# Altium schematic sheet 4th_main.SchDoc
size A1
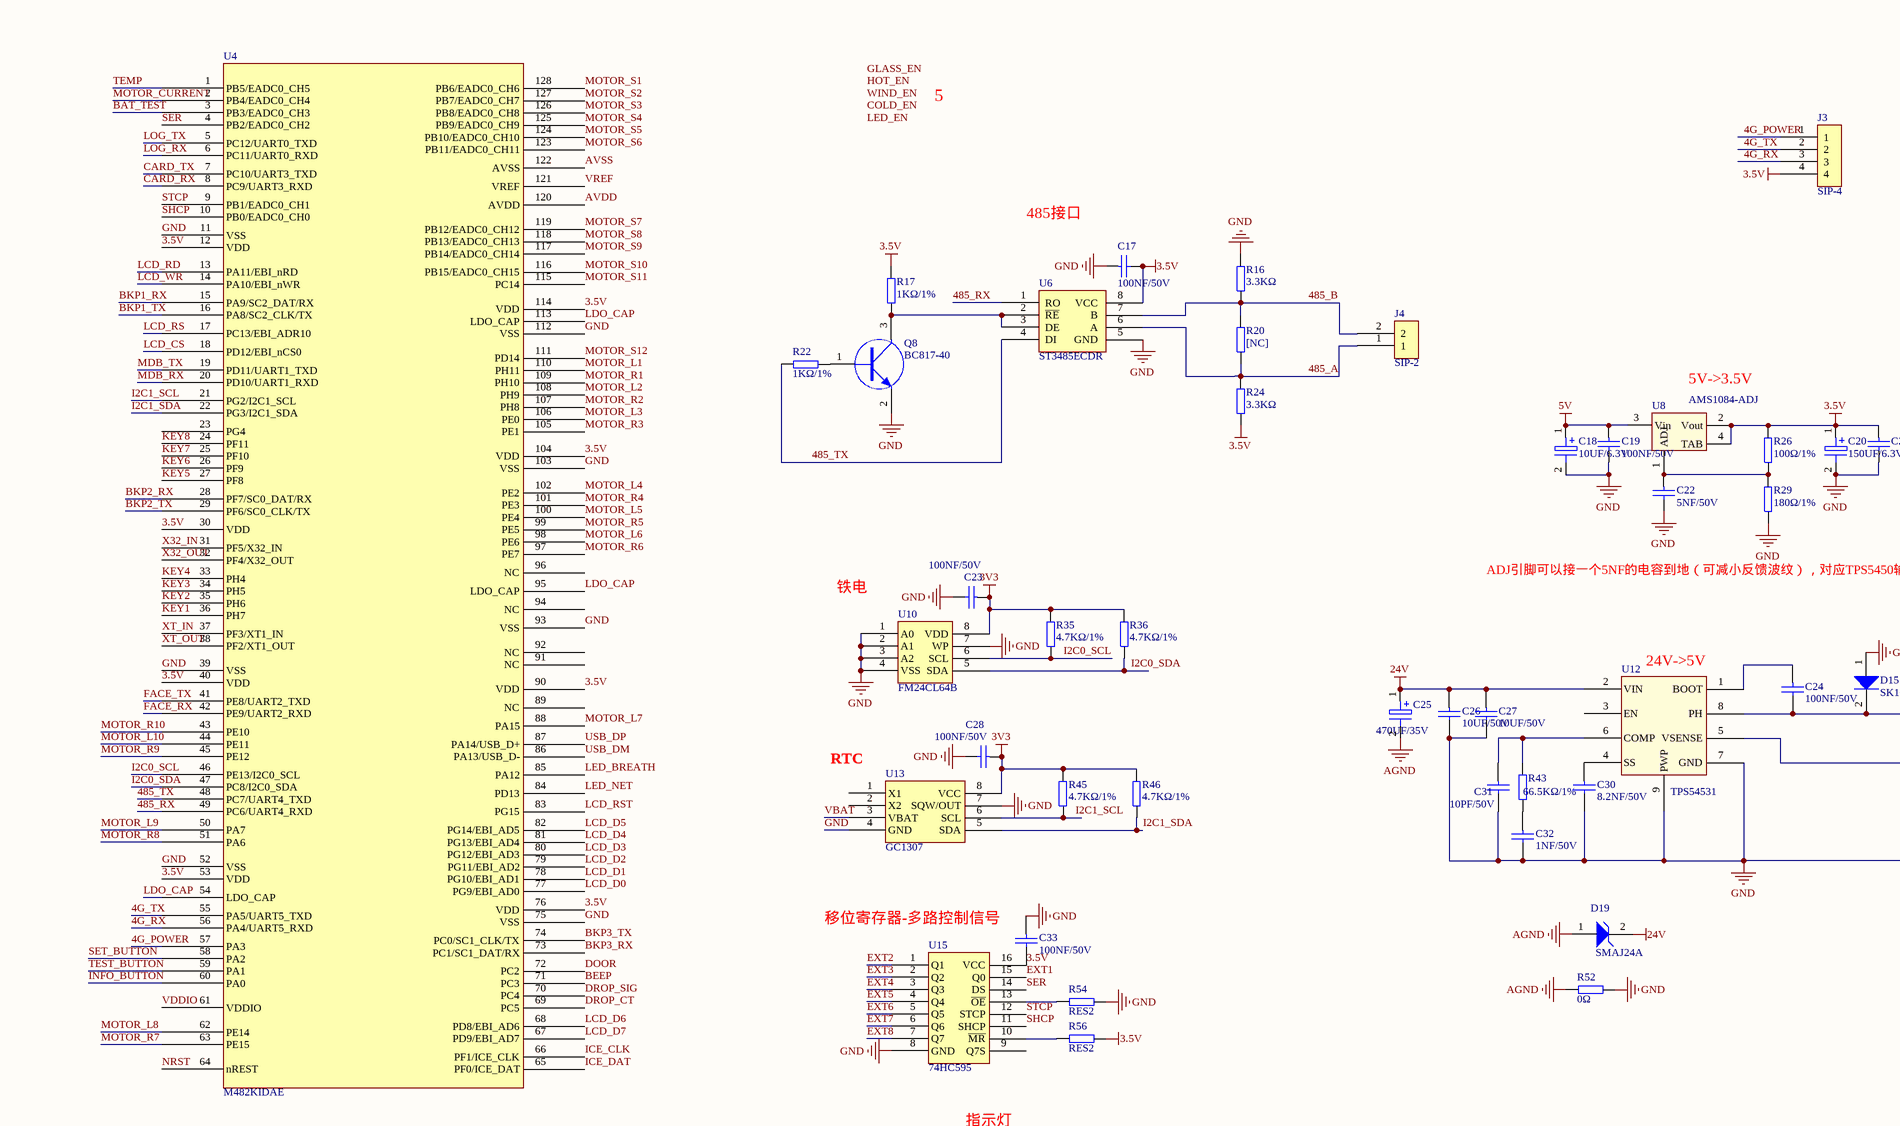
[diagram p0: 4th_main.SchDoc, top left]
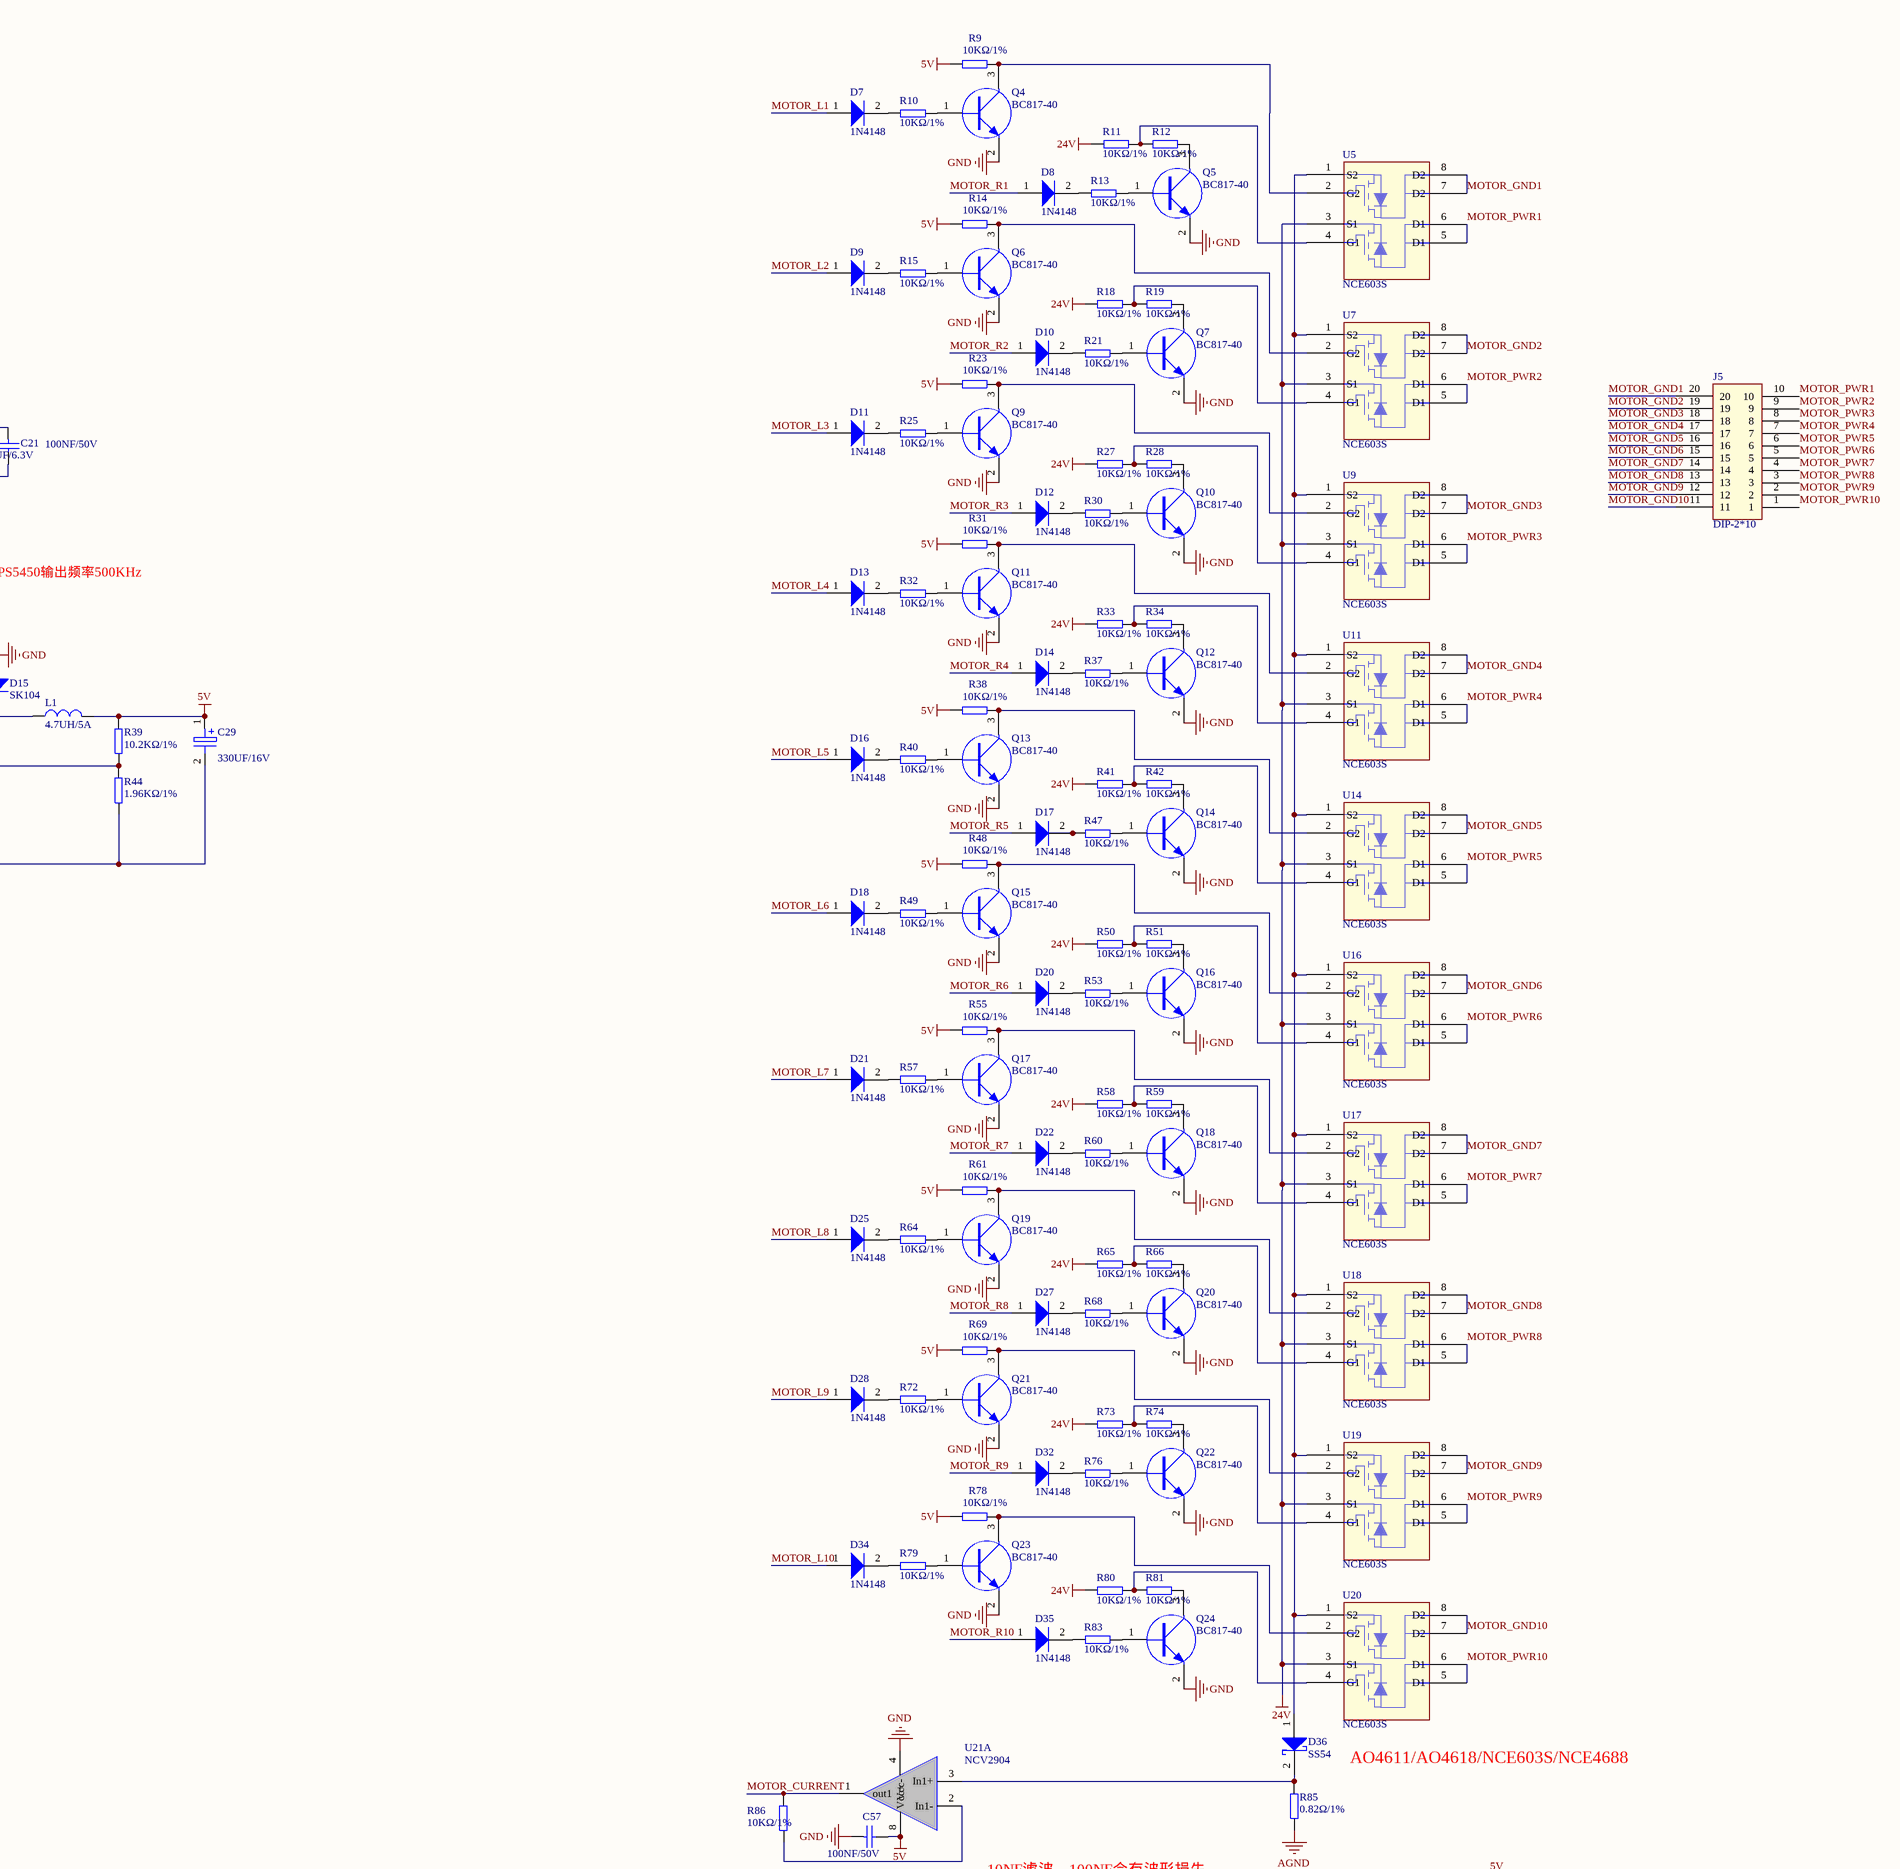
[diagram p1: 4th_main.SchDoc, top right]
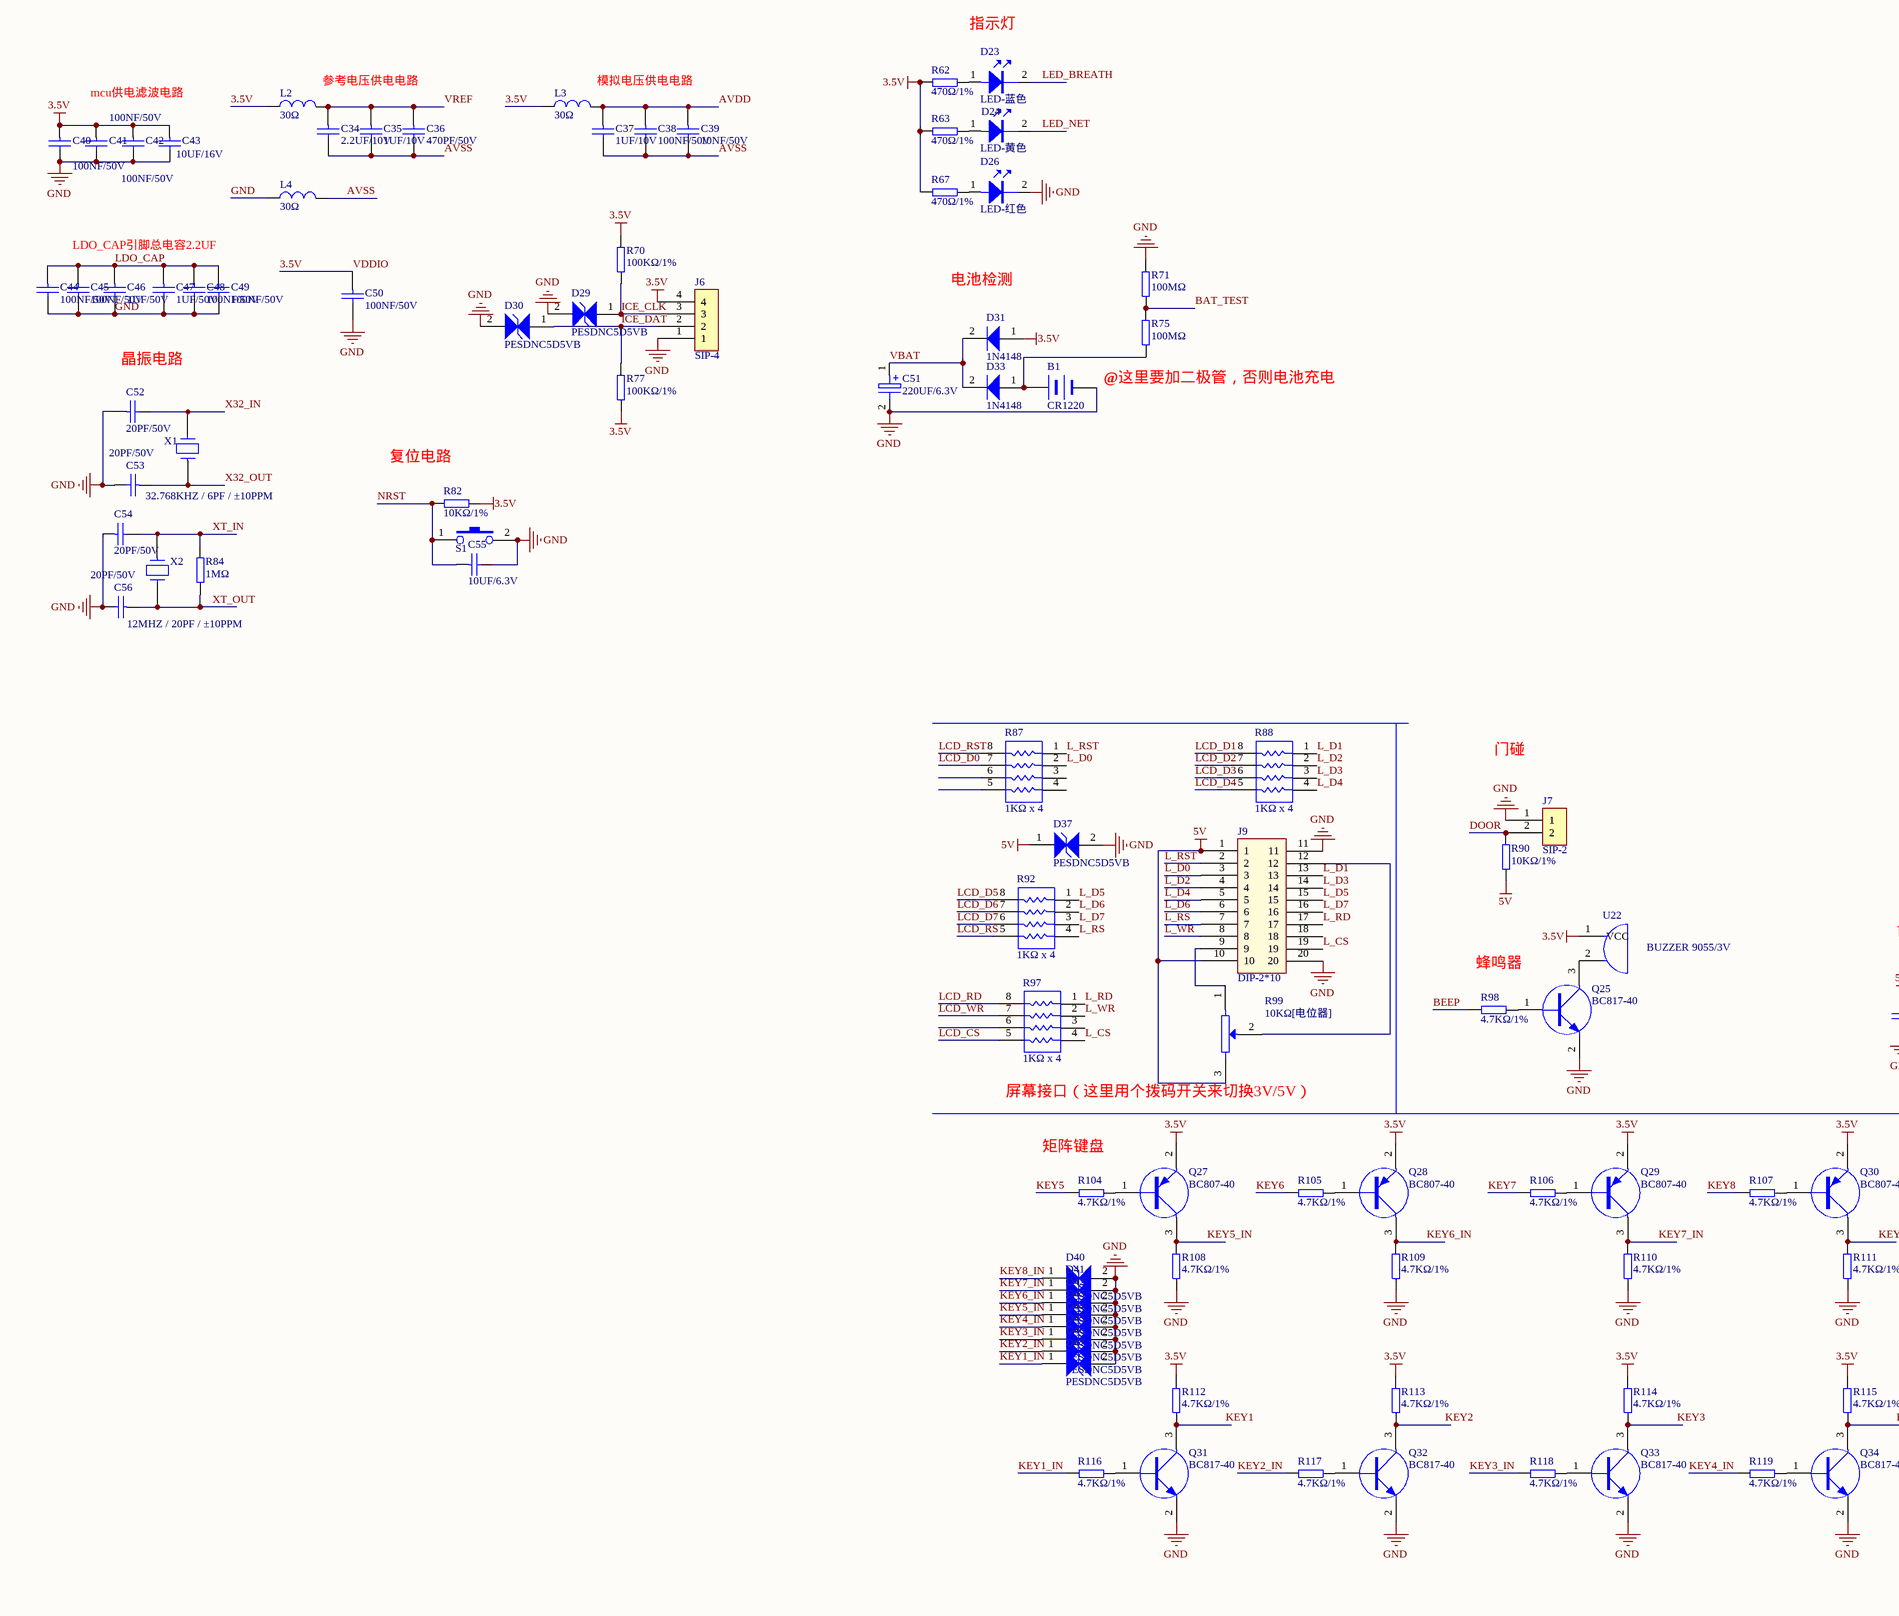
[diagram p2: 4th_main.SchDoc, bottom left]
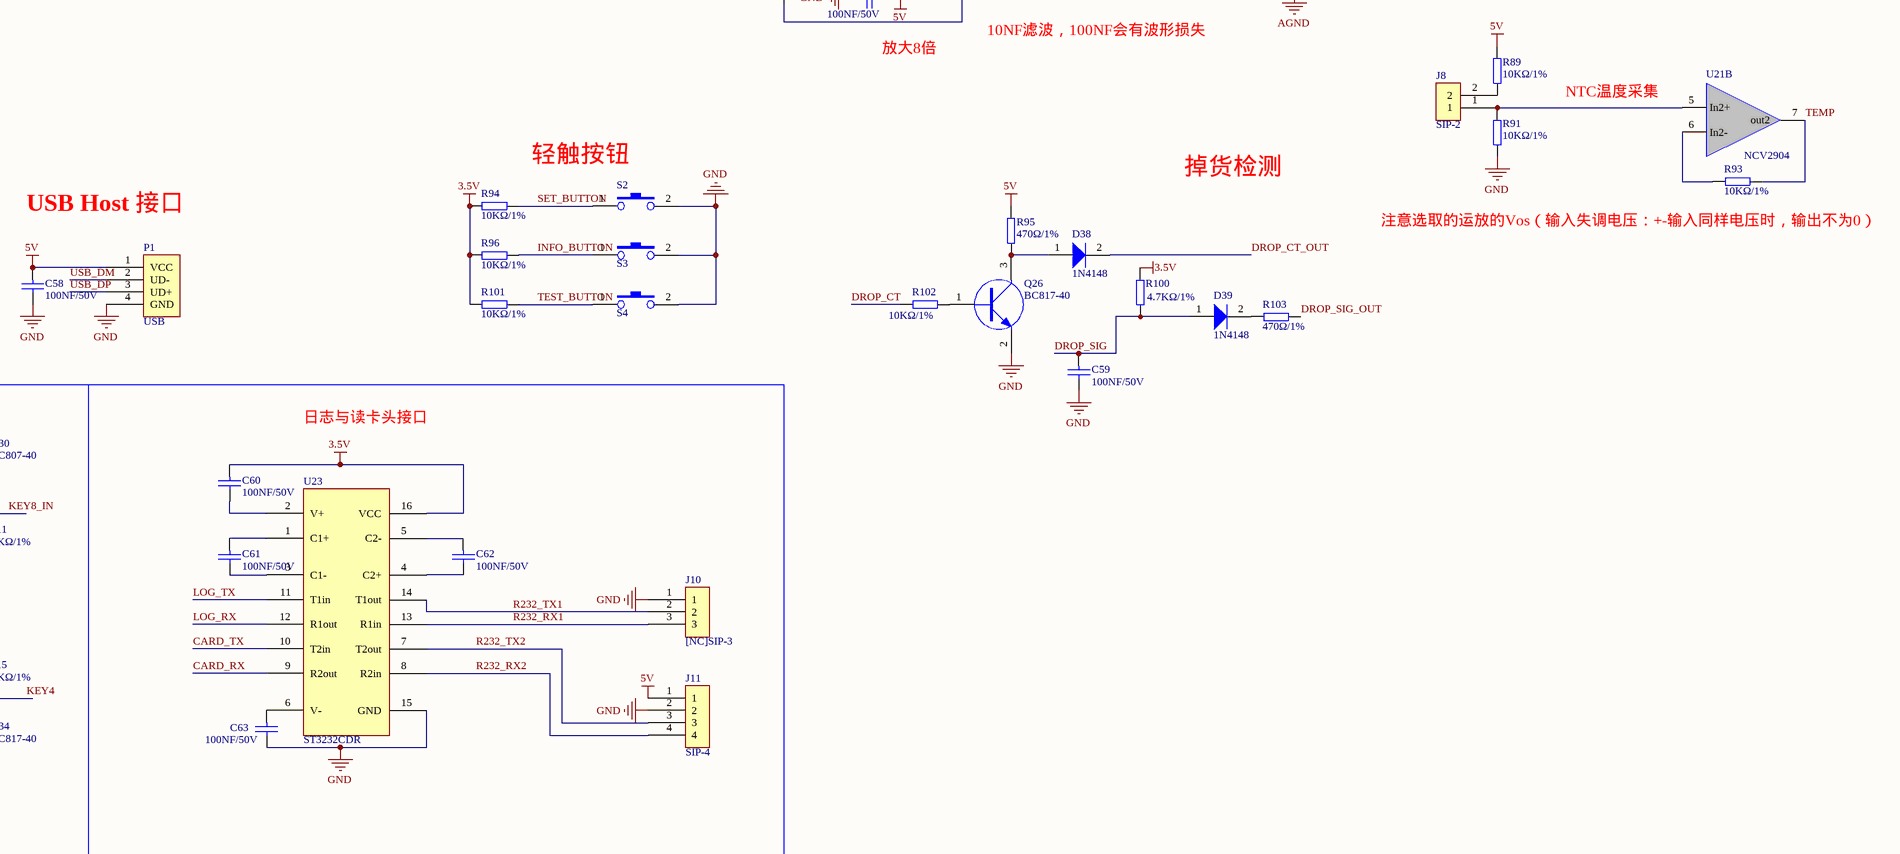
[diagram p3: 4th_main.SchDoc, bottom right]

## Parts
B1  CR1220  [CR1220]
C17  100NF/50V  [0603_C]
C18  10UF/6.3V  [CASE-A_3216]
C19  100NF/50V  [0603_C]
C20  150UF/6.3V  [CASE-B_3528]
C21  100NF/50V  [0603_C]
C22  5NF/50V  [0603_C]
C23  100NF/50V  [0603_C]
C24  100NF/50V  [0603_C]
C25  470UF/35V  [CAP-TH_BD10.0-P5.00-D1.0-FD]
C26  10UF/50V  [1206_C]
C27  10UF/50V  [1206_C]
C28  100NF/50V  [0603_C]
C29  330UF/16V  [CAP-TH_BD8.0-P3.50-D1.0-FD]
C30  8.2NF/50V  [0603_C]
C31  10PF/50V  [0603_C]
C32  1NF/50V  [0603_C]
C33  100NF/50V  [0603_C]
C34  2.2UF/10V  [0603_C]
C35  1UF/10V  [0603_C]
C36  470PF/50V  [0603_C]
C37  1UF/10V  [0603_C]
C38  100NF/50V  [0603_C]
C39  10NF/50V  [0603_C]
C40  100NF/50V  [0603_C]
C41  100NF/50V  [0603_C]
C42  100NF/50V  [0603_C]
C43  10UF/16V  [0603_C]
C44  100NF/50V  [0603_C]
C45  100NF/50V  [0603_C]
C46  1UF/50V  [0603_C]
C47  1UF/50V  [0603_C]
C48  100NF/50V  [0603_C]
C49  100NF/50V  [0603_C]
C50  100NF/50V  [0603_C]
C51  220UF/6.3V  [CASE-B_3528]
C52  20PF/50V  [0603_C]
C53  20PF/50V  [0603_C]
C54  20PF/50V  [0603_C]
C55  10UF/6.3V  [0603_C]
C56  20PF/50V  [0603_C]
C57  100NF/50V  [0603_C]
C58  100NF/50V  [0603_C]
C59  100NF/50V  [0603_C]
C60  100NF/50V  [0603_C]
C61  100NF/50V  [0603_C]
C62  100NF/50V  [0603_C]
C63  100NF/50V  [0603_C]
D7  1N4148  [SOD-123_L2.8-W1.8-LS3.7-RD]
D8  1N4148  [SOD-123_L2.8-W1.8-LS3.7-RD]
D9  1N4148  [SOD-123_L2.8-W1.8-LS3.7-RD]
D10  1N4148  [SOD-123_L2.8-W1.8-LS3.7-RD]
D11  1N4148  [SOD-123_L2.8-W1.8-LS3.7-RD]
D12  1N4148  [SOD-123_L2.8-W1.8-LS3.7-RD]
D13  1N4148  [SOD-123_L2.8-W1.8-LS3.7-RD]
D14  1N4148  [SOD-123_L2.8-W1.8-LS3.7-RD]
D15  SK104  [SMC/DO214AB]
D16  1N4148  [SOD-123_L2.8-W1.8-LS3.7-RD]
D17  1N4148  [SOD-123_L2.8-W1.8-LS3.7-RD]
D18  1N4148  [SOD-123_L2.8-W1.8-LS3.7-RD]
D19  SMAJ24A  [SMA/DO214AC]
D20  1N4148  [SOD-123_L2.8-W1.8-LS3.7-RD]
D21  1N4148  [SOD-123_L2.8-W1.8-LS3.7-RD]
D22  1N4148  [SOD-123_L2.8-W1.8-LS3.7-RD]
D23  LED-蓝色  [0603_D]
D24  LED-黄色  [0603_D]
D25  1N4148  [SOD-123_L2.8-W1.8-LS3.7-RD]
D26  LED-红色  [0603_D]
D27  1N4148  [SOD-123_L2.8-W1.8-LS3.7-RD]
D28  1N4148  [SOD-123_L2.8-W1.8-LS3.7-RD]
D29  PESDNC5D5VB  [SOD-523]
D30  PESDNC5D5VB  [SOD-523]
D31  1N4148  [LL34_2P]
D32  1N4148  [SOD-123_L2.8-W1.8-LS3.7-RD]
D33  1N4148  [LL34_2P]
D34  1N4148  [SOD-123_L2.8-W1.8-LS3.7-RD]
D35  1N4148  [SOD-123_L2.8-W1.8-LS3.7-RD]
D36  SS54  [SMA/DO214AC]
D37  PESDNC5D5VB  [SOD-523]
D38  1N4148  [SOD-123_L2.8-W1.8-LS3.7-RD]
D39  1N4148  [SOD-123_L2.8-W1.8-LS3.7-RD]
D40  PESDNC5D5VB  [SOD-523]
D41  PESDNC5D5VB  [SOD-523]
D42  PESDNC5D5VB  [SOD-523]
D43  PESDNC5D5VB  [SOD-523]
D44  PESDNC5D5VB  [SOD-523]
D45  PESDNC5D5VB  [SOD-523]
D46  PESDNC5D5VB  [SOD-523]
D47  PESDNC5D5VB  [SOD-523]
J3  SIP-4  [XHB-4A]
J4  SIP-2  [PHS-2AW]
J5  DIP-2*10  [5557-2*10A]
J6  SIP-4  [XHB-4A]
J7  SIP-2  [PHS-2AW]
J8  SIP-2  [XHB-2A]
J9  DIP-2*10  [PHB-2*10AW]
J10  [NC]SIP-3  [XHB-3A]
J11  SIP-4  [PHS-4AW]
L1  4.7UH/5A  [IND-SMD_0630]
L2  30Ω  [0603_L]
L3  30Ω  [0603_L]
L4  30Ω  [0603_L]
P1  USB  [USB-180度-10mm超短]
Q4  BC817-40  [SOT-23-3]
Q5  BC817-40  [SOT-23-3]
Q6  BC817-40  [SOT-23-3]
Q7  BC817-40  [SOT-23-3]
Q8  BC817-40  [SOT-23-3]
Q9  BC817-40  [SOT-23-3]
Q10  BC817-40  [SOT-23-3]
Q11  BC817-40  [SOT-23-3]
Q12  BC817-40  [SOT-23-3]
Q13  BC817-40  [SOT-23-3]
Q14  BC817-40  [SOT-23-3]
Q15  BC817-40  [SOT-23-3]
Q16  BC817-40  [SOT-23-3]
Q17  BC817-40  [SOT-23-3]
Q18  BC817-40  [SOT-23-3]
Q19  BC817-40  [SOT-23-3]
Q20  BC817-40  [SOT-23-3]
Q21  BC817-40  [SOT-23-3]
Q22  BC817-40  [SOT-23-3]
Q23  BC817-40  [SOT-23-3]
Q24  BC817-40  [SOT-23-3]
Q25  BC817-40  [SOT-23-3]
Q26  BC817-40  [SOT-23-3]
Q27  BC807-40  [SOT-23-3]
Q28  BC807-40  [SOT-23-3]
Q29  BC807-40  [SOT-23-3]
Q30  BC807-40  [SOT-23-3]
Q31  BC817-40  [SOT-23-3]
Q32  BC817-40  [SOT-23-3]
Q33  BC817-40  [SOT-23-3]
Q34  BC817-40  [SOT-23-3]
R9  10KΩ/1%  [0603_R]
R10  10KΩ/1%  [0603_R]
R11  10KΩ/1%  [0603_R]
R12  10KΩ/1%  [0603_R]
R13  10KΩ/1%  [0603_R]
R14  10KΩ/1%  [0603_R]
R15  10KΩ/1%  [0603_R]
R16  3.3KΩ  [0603_R]
R17  1KΩ/1%  [0603_R]
R18  10KΩ/1%  [0603_R]
R19  10KΩ/1%  [0603_R]
R20  [NC]  [0603_R]
R21  10KΩ/1%  [0603_R]
R22  1KΩ/1%  [0603_R]
R23  10KΩ/1%  [0603_R]
R24  3.3KΩ  [0603_R]
R25  10KΩ/1%  [0603_R]
R26  100Ω/1%  [0603_R]
R27  10KΩ/1%  [0603_R]
R28  10KΩ/1%  [0603_R]
R29  180Ω/1%  [0603_R]
R30  10KΩ/1%  [0603_R]
R31  10KΩ/1%  [0603_R]
R32  10KΩ/1%  [0603_R]
R33  10KΩ/1%  [0603_R]
R34  10KΩ/1%  [0603_R]
R35  4.7KΩ/1%  [0603_R]
R36  4.7KΩ/1%  [0603_R]
R37  10KΩ/1%  [0603_R]
R38  10KΩ/1%  [0603_R]
R39  10.2KΩ/1%  [0603_R]
R40  10KΩ/1%  [0603_R]
R41  10KΩ/1%  [0603_R]
R42  10KΩ/1%  [0603_R]
R43  66.5KΩ/1%  [0603_R]
R44  1.96KΩ/1%  [0603_R]
R45  4.7KΩ/1%  [0603_R]
R46  4.7KΩ/1%  [0603_R]
R47  10KΩ/1%  [0603_R]
R48  10KΩ/1%  [0603_R]
R49  10KΩ/1%  [0603_R]
R50  10KΩ/1%  [0603_R]
R51  10KΩ/1%  [0603_R]
R52  0Ω  [1812_R]
R53  10KΩ/1%  [0603_R]
R54  RES2  [0603_R]
R55  10KΩ/1%  [0603_R]
R56  RES2  [0603_R]
R57  10KΩ/1%  [0603_R]
R58  10KΩ/1%  [0603_R]
R59  10KΩ/1%  [0603_R]
R60  10KΩ/1%  [0603_R]
R61  10KΩ/1%  [0603_R]
R62  470Ω/1%  [0603_R]
R63  470Ω/1%  [0603_R]
R64  10KΩ/1%  [0603_R]
R65  10KΩ/1%  [0603_R]
R66  10KΩ/1%  [0603_R]
R67  470Ω/1%  [0603_R]
R68  10KΩ/1%  [0603_R]
R69  10KΩ/1%  [0603_R]
R70  100KΩ/1%  [0603_R]
R71  100MΩ  [0603_R]
R72  10KΩ/1%  [0603_R]
R73  10KΩ/1%  [0603_R]
R74  10KΩ/1%  [0603_R]
R75  100MΩ  [0603_R]
R76  10KΩ/1%  [0603_R]
R77  100KΩ/1%  [0603_R]
R78  10KΩ/1%  [0603_R]
R79  10KΩ/1%  [0603_R]
R80  10KΩ/1%  [0603_R]
R81  10KΩ/1%  [0603_R]
R82  10KΩ/1%  [0603_R]
R83  10KΩ/1%  [0603_R]
R84  1MΩ  [0603_R]
R85  0.82Ω/1%  [1812_R]
R86  10KΩ/1%  [0603_R]
R87  1KΩ x 4  [0402_Rx4]
R88  1KΩ x 4  [0402_Rx4]
R89  10KΩ/1%  [0603_R]
R90  10KΩ/1%  [0603_R]
R91  10KΩ/1%  [0603_R]
R92  1KΩ x 4  [0402_Rx4]
R93  10KΩ/1%  [0603_R]
R94  10KΩ/1%  [0603_R]
R95  470Ω/1%  [0603_R]
R96  10KΩ/1%  [0603_R]
R97  1KΩ x 4  [0402_Rx4]
R98  4.7KΩ/1%  [0603_R]
R99  10KΩ[电位器]  [3362P]
R100  4.7KΩ/1%  [0603_R]
R101  10KΩ/1%  [0603_R]
R102  10KΩ/1%  [0603_R]
R103  470Ω/1%  [0603_R]
R104  4.7KΩ/1%  [0603_R]
R105  4.7KΩ/1%  [0603_R]
R106  4.7KΩ/1%  [0603_R]
R107  4.7KΩ/1%  [0603_R]
R108  4.7KΩ/1%  [0603_R]
R109  4.7KΩ/1%  [0603_R]
R110  4.7KΩ/1%  [0603_R]
R111  4.7KΩ/1%  [0603_R]
R112  4.7KΩ/1%  [0603_R]
R113  4.7KΩ/1%  [0603_R]
R114  4.7KΩ/1%  [0603_R]
R115  4.7KΩ/1%  [0603_R]
R116  4.7KΩ/1%  [0603_R]
R117  4.7KΩ/1%  [0603_R]
R118  4.7KΩ/1%  [0603_R]
R119  4.7KΩ/1%  [0603_R]
S1  SW-PB  [SW-TH_4P-L12.0-W12.0-P5.00-LS12.5]  (value not drawn)
S2  SW-PB  [SW-6*6]  (value not drawn)
S3  SW-PB  [SW-6*6]  (value not drawn)
S4  SW-PB  [SW-6*6]  (value not drawn)
U4  M482KIDAE  [LQFP-128_L14.0-W14.0-P0.40-LS16.0-BL]
U5  NCE603S  [SO-8（1.27/3.8*5）]
U6  ST3485ECDR  [SO-8（1.27/3.8*5）]
U7  NCE603S  [SO-8（1.27/3.8*5）]
U8  AMS1084-ADJ  [TO-252]
U9  NCE603S  [SO-8（1.27/3.8*5）]
U10  FM24CL64B  [SO-8（1.27/3.8*5）]
U11  NCE603S  [SO-8（1.27/3.8*5）]
U12  TPS54531  [SO-8-POWERPAD（1.27/3.8*5）]
U13  GC1307  [SO-8（1.27/3.8*5）]
U14  NCE603S  [SO-8（1.27/3.8*5）]
U15  74HC595  [SO-16（1.27/3.8*10）]
U16  NCE603S  [SO-8（1.27/3.8*5）]
U17  NCE603S  [SO-8（1.27/3.8*5）]
U18  NCE603S  [SO-8（1.27/3.8*5）]
U19  NCE603S  [SO-8（1.27/3.8*5）]
U20  NCE603S  [SO-8（1.27/3.8*5）]
U21  NCV2904  [SO-8（1.27/3.8*5）]  (parts A,B of 2)
U22  BUZZER 9055/3V  [BUZZ-9055/5.0mm]
U23  ST3232CDR  [SO-16（1.27/3.8*10）]
X1  32.768KHZ / 6PF / ±10PPM  [SMD-3215-2P]
X2  12MHZ / 20PF / ±10PPM  [SMD-5032_2P]

## Nets
3.5V: C17.2 C20.1 C21.1 C33.2 C40.1 C41.1 C42.1 C43.1 C50.1 C60.1 D31.1(A) J3.4 J6.4 L2.1 L3.1 Q27.2 Q28.2 Q29.2 Q30.2 R17.2 R24.1 R26.2 R56.2 R62.1 R63.1 R67.1 R70.2 R77.1 R82.2 R94.1 R96.1 R100.2 R101.1 R112.2 R113.2 R114.2 R115.2 U4.12(VDD) U4.30(VDD) U4.40(VDD) U4.53(VDD) U4.61(VDDIO) U4.76(VDD) U4.90(VDD) U4.104(VDD) U4.114(VDD) U6.8(VCC) U8.2(Vout) U8.4(TAB) U15.16(VCC) U22.1(VCC) U23.16(VCC)  [also labelled VDDIO]
3V3: C23.1 C28.1 R35.2 R36.2 R45.2 R46.2 U10.8(VDD) U13.8(VCC)
5V: C18.1 C19.1 C29.1 C57.2 C58.1 D37.1 J9.1 J9.10 J11.1 L1.2 P1.1(VCC) R9.1 R14.1 R23.1 R31.1 R38.1 R39.2 R48.1 R55.1 R61.1 R69.1 R78.1 R89.2 R90.2 R95.2 R99.3 U8.3(Vin) U21.8(Vcc+)
24V: C25.1 C26.1 C27.1 D19.2(K) R11.1 R18.1 R27.1 R33.1 R41.1 R50.1 R58.1 R65.1 R73.1 R80.1 U5.3(S1) U7.3(S1) U9.3(S1) U11.3(S1) U12.2(VIN) U14.3(S1) U16.3(S1) U17.3(S1) U18.3(S1) U19.3(S1) U20.3(S1)
AGND: C25.2 D19.1 R52.1 R85.1
GND: B1.2(-) C17.1 C18.2 C19.2 C20.2 C21.2 C22.2 C23.2 C26.2 C27.2 C28.2 C29.2 C30.2 C31.2 C32.2 C33.1 C40.2 C41.2 C42.2 C43.2 C44.2 C45.2 C46.2 C47.2 C48.2 C49.2 C50.2 C51.2 C52.1 C53.2 C54.1 C55.2 C56.2 C57.1 C58.2 C59.2 C63.2 D15.1(A) D26.2 D29.2(K) D30.2(K) D37.2(K) D40.2(K) D41.2(K) D42.2(K) D43.2(K) D44.2(K) D45.2(K) D46.2(K) D47.2(K) J6.1 J7.1 J9.11 J9.20 J10.1 J11.2 L4.1 P1.4(GND) Q4.2 Q5.2 Q6.2 Q7.2 Q8.2 Q9.2 Q10.2 Q11.2 Q12.2 Q13.2 Q14.2 Q15.2 Q16.2 Q17.2 Q18.2 Q19.2 Q20.2 Q21.2 Q22.2 Q23.2 Q24.2 Q25.2 Q26.2 Q31.2 Q32.2 Q33.2 Q34.2 R16.2 R29.1 R44.1 R52.2 R54.2 R71.2 R91.1 R108.1 R109.1 R110.1 R111.1 S1.2 S2.2 S3.2 S4.2 U4.11(VSS) U4.39(VSS) U4.52(VSS) U4.75(VSS) U4.93(VSS) U4.103(VSS) U4.112(VSS) U6.5(GND) U10.1(A0) U10.2(A1) U10.3(A2) U10.4(VSS) U10.7(WP) U12.7(GND) U12.9(PWP) U13.4(GND) U13.7(SQW/OUT) U15.8(GND) U21.4(Vcc-) U23.15(GND)
4G_POWER: J3.1 U4.57(PA3)
4G_RX: J3.3 U4.56(PA4/UART5_RXD)
4G_TX: J3.2 U4.55(PA5/UART5_TXD)
485_A: J4.1 R20.1 R24.2 U6.6(A)
485_B: J4.2 R16.1 R20.2 U6.7(B)
485_RX: U4.49(PC6/UART4_RXD) U6.1(RO)
485_TX: R22.1 U4.48(PC7/UART4_TXD) U6.4(DI)
AVDD: C37.1 C38.1 C39.1 L3.2 U4.120(AVDD)
AVSS: C34.2 C35.2 C36.2 C37.2 C38.2 C39.2 L4.2 U4.122(AVSS)
BAT_TEST: R71.1 R75.2 U4.3(PB3/EADC0_CH3)
BEEP: R98.1 U4.71(PC3)
BKP1_RX: U4.15(PA9/SC2_DAT/RX)
BKP1_TX: U4.16(PA8/SC2_CLK/TX)
BKP2_RX: U4.28(PF7/SC0_DAT/RX)
BKP2_TX: U4.29(PF6/SC0_CLK/TX)
BKP3_RX: U4.73(PC1/SC1_DAT/RX)
BKP3_TX: U4.74(PC0/SC1_CLK/TX)
CARD_RX: U4.8(PC9/UART3_RXD) U23.9(R2out)
CARD_TX: U4.7(PC10/UART3_TXD) U23.10(T2in)
DOOR: J7.2 R90.1 U4.72(PC2)
DROP_CT: R102.1 U4.69(PC5)
DROP_CT_OUT: D38.2(K)
DROP_SIG: C59.1 D39.1(A) R100.1 U4.70(PC4)
DROP_SIG_OUT: R103.2
EXT1: U15.15(Q0)
EXT2: U15.1(Q1)
EXT3: U15.2(Q2)
EXT4: U15.3(Q3)
EXT5: U15.4(Q4)
EXT6: U15.5(Q5)
EXT7: U15.6(Q6)
EXT8: U15.7(Q7)
FACE_RX: U4.42(PE9/UART2_RXD)
FACE_TX: U4.41(PE8/UART2_TXD)
I2C0_SCL: R35.1 U4.46(PE13/I2C0_SCL) U10.6(SCL)
I2C0_SDA: R36.1 U4.47(PC8/I2C0_SDA) U10.5(SDA)
I2C1_SCL: R45.1 U4.21(PG2/I2C1_SCL) U13.6(SCL)
I2C1_SDA: R46.1 U4.22(PG3/I2C1_SDA) U13.5(SDA)
ICE_CLK: D29.1 J6.3 R70.1 U4.66(PF1/ICE_CLK)
ICE_DAT: D30.1 J6.2 R77.2 U4.65(PF0/ICE_DAT)
INFO_BUTTON: R96.2 S3.1 U4.60(PA0)
KEY1: Q31.3 R112.1 U4.36(PH7)
KEY1_IN: D47.1 R116.1
KEY2: Q32.3 R113.1 U4.35(PH6)
KEY2_IN: D46.1 R117.1
KEY3: Q33.3 R114.1 U4.34(PH5)
KEY3_IN: D45.1 R118.1
KEY4: Q34.3 R115.1 U4.33(PH4)
KEY4_IN: D44.1 R119.1
KEY5: R104.1 U4.27(PF8)
KEY5_IN: D43.1 Q27.3 R108.2
KEY6: R105.1 U4.26(PF9)
KEY6_IN: D42.1 Q28.3 R109.2
KEY7: R106.1 U4.25(PF10)
KEY7_IN: D41.1 Q29.3 R110.2
KEY8: R107.1 U4.24(PF11)
KEY8_IN: D40.1 Q30.3 R111.2
L_CS: J9.19 R97.4
L_D0: J9.3 R87.2
L_D1: J9.13 R88.1
L_D2: J9.4 R88.2
L_D3: J9.14 R88.3
L_D4: J9.5 R88.4
L_D5: J9.15 R92.1
L_D6: J9.6 R92.2
L_D7: J9.16 R92.3
L_RD: J9.17 R97.1
L_RS: J9.7 R92.4
L_RST: J9.2 R87.1
L_WR: J9.8 R97.2
LCD_CS: R97.5 U4.18(PD12/EBI_nCS0)
LCD_D0: R87.7 U4.77(PG9/EBI_AD0)
LCD_D1: R88.8 U4.78(PG10/EBI_AD1)
LCD_D2: R88.7 U4.79(PG11/EBI_AD2)
LCD_D3: R88.6 U4.80(PG12/EBI_AD3)
LCD_D4: R88.5 U4.81(PG13/EBI_AD4)
LCD_D5: R92.8 U4.82(PG14/EBI_AD5)
LCD_D6: R92.7 U4.68(PD8/EBI_AD6)
LCD_D7: R92.6 U4.67(PD9/EBI_AD7)
LCD_RD: R97.8 U4.13(PA11/EBI_nRD)
LCD_RS: R92.5 U4.17(PC13/EBI_ADR10)
LCD_RST: R87.8 U4.83(PG15)
LCD_WR: R97.7 U4.14(PA10/EBI_nWR)
LDO_CAP: C44.1 C45.1 C46.1 C47.1 C48.1 C49.1 U4.54(LDO_CAP) U4.95(LDO_CAP) U4.113(LDO_CAP)
LED_BREATH: D23.2 U4.85(PA12)
LED_NET: D24.2 U4.84(PD13)
LOG_RX: U4.6(PC11/UART0_RXD) U23.12(R1out)
LOG_TX: U4.5(PC12/UART0_TXD) U23.11(T1in)
MDB_RX: U4.20(PD10/UART1_RXD)
MDB_TX: U4.19(PD11/UART1_TXD)
MOTOR_CURRENT: R86.2 U4.2(PB4/EADC0_CH4) U21.1(out1)
MOTOR_GND1: J5.20 U5.7(D2) U5.8(D2)
MOTOR_GND2: J5.19 U7.7(D2) U7.8(D2)
MOTOR_GND3: J5.18 U9.7(D2) U9.8(D2)
MOTOR_GND4: J5.17 U11.7(D2) U11.8(D2)
MOTOR_GND5: J5.16 U14.7(D2) U14.8(D2)
MOTOR_GND6: J5.15 U16.7(D2) U16.8(D2)
MOTOR_GND7: J5.14 U17.7(D2) U17.8(D2)
MOTOR_GND8: J5.13 U18.7(D2) U18.8(D2)
MOTOR_GND9: J5.12 U19.7(D2) U19.8(D2)
MOTOR_GND10: J5.11 U20.7(D2) U20.8(D2)
MOTOR_L1: D7.1(A) U4.110(PH11)
MOTOR_L2: D9.1(A) U4.108(PH9)
MOTOR_L3: D11.1(A) U4.106(PE0)
MOTOR_L4: D13.1(A) U4.102(PE2)
MOTOR_L5: D16.1(A) U4.100(PE4)
MOTOR_L6: D18.1(A) U4.98(PE6)
MOTOR_L7: D21.1(A) U4.88(PA15)
MOTOR_L8: D25.1(A) U4.62(PE14)
MOTOR_L9: D28.1(A) U4.50(PA7)
MOTOR_L10: D34.1(A) U4.44(PE11)
MOTOR_PWR1: J5.10 U5.5(D1) U5.6(D1)
MOTOR_PWR2: J5.9 U7.5(D1) U7.6(D1)
MOTOR_PWR3: J5.8 U9.5(D1) U9.6(D1)
MOTOR_PWR4: J5.7 U11.5(D1) U11.6(D1)
MOTOR_PWR5: J5.6 U14.5(D1) U14.6(D1)
MOTOR_PWR6: J5.5 U16.5(D1) U16.6(D1)
MOTOR_PWR7: J5.4 U17.5(D1) U17.6(D1)
MOTOR_PWR8: J5.3 U18.5(D1) U18.6(D1)
MOTOR_PWR9: J5.2 U19.5(D1) U19.6(D1)
MOTOR_PWR10: J5.1 U20.5(D1) U20.6(D1)
MOTOR_R1: D8.1(A) U4.109(PH10)
MOTOR_R2: D10.1(A) U4.107(PH8)
MOTOR_R3: D12.1(A) U4.105(PE1)
MOTOR_R4: D14.1(A) U4.101(PE3)
MOTOR_R5: D17.1(A) U4.99(PE5)
MOTOR_R6: D20.1(A) U4.97(PE7)
MOTOR_R7: D22.1(A) U4.63(PE15)
MOTOR_R8: D27.1(A) U4.51(PA6)
MOTOR_R9: D32.1(A) U4.45(PE12)
MOTOR_R10: D35.1(A) U4.43(PE10)
MOTOR_S1: U4.128(PB6/EADC0_CH6)
MOTOR_S2: U4.127(PB7/EADC0_CH7)
MOTOR_S3: U4.126(PB8/EADC0_CH8)
MOTOR_S4: U4.125(PB9/EADC0_CH9)
MOTOR_S5: U4.124(PB10/EADC0_CH10)
MOTOR_S6: U4.123(PB11/EADC0_CH11)
MOTOR_S7: U4.119(PB12/EADC0_CH12)
MOTOR_S8: U4.118(PB13/EADC0_CH13)
MOTOR_S9: U4.117(PB14/EADC0_CH14)
MOTOR_S10: U4.116(PB15/EADC0_CH15)
MOTOR_S11: U4.115(PC14)
MOTOR_S12: U4.111(PD14)
NRST: C55.1 R82.1 S1.1 U4.64(nREST)
R232_RX1: J10.3 U23.13(R1in)
R232_RX2: J11.4 U23.8(R2in)
R232_TX1: J10.2 U23.14(T1out)
R232_TX2: J11.3 U23.7(T2out)
SER: U4.4(PB2/EADC0_CH2) U15.14(DS)
SET_BUTTON: R94.2 S2.1 U4.58(PA2)
SHCP: U4.10(PB0/EADC0_CH0) U15.11(SHCP)
STCP: U4.9(PB1/EADC0_CH1) U15.12(STCP)
TEMP: R93.2 U4.1(PB5/EADC0_CH5) U21.7(out2)
TEST_BUTTON: R101.2 S4.1 U4.59(PA1)
USB_DM: P1.2(UD-) U4.86(PA13/USB_D-)
USB_DP: P1.3(UD+) U4.87(PA14/USB_D+)
VBAT: C51.1 D31.2(K) D33.2(K) U13.3(VBAT)
VREF: C34.1 C35.1 C36.1 L2.2 U4.121(VREF)
X32_IN: C52.2 U4.31(PF5/X32_IN) X1.2
X32_OUT: C53.1 U4.32(PF4/X32_OUT) X1.1
XT_IN: C54.2 R84.1 U4.37(PF3/XT1_IN) X2.1
XT_OUT: C56.1 R84.2 U4.38(PF2/XT1_OUT) X2.2
NetB1_1: B1.1(+) D33.1(A) R75.1
NetC22_1: C22.1 R26.1 R29.2 U8.1(ADJ)
NetC24_1: C24.1 U12.1(BOOT)
NetC24_2: C24.2 D15.2(K) L1.1 U12.8(PH)
NetC30_1: C30.1 U12.4(SS)
NetC31_1: C31.1 R43.2 U12.6(COMP)
NetC32_1: C32.1 R43.1
NetC60_2: C60.2 U23.2(V+)
NetC61_1: C61.1 U23.1(C1+)
NetC61_2: C61.2 U23.3(C1-)
NetC62_1: C62.1 U23.5(C2-)
NetC62_2: C62.2 U23.4(C2+)
NetC63_1: C63.1 U23.6(V-)
NetD7_2: D7.2(K) R10.1
NetD8_2: D8.2(K) R13.1
NetD9_2: D9.2(K) R15.1
NetD10_2: D10.2(K) R21.1
NetD11_2: D11.2(K) R25.1
NetD12_2: D12.2(K) R30.1
NetD13_2: D13.2(K) R32.1
NetD14_2: D14.2(K) R37.1
NetD16_2: D16.2(K) R40.1
NetD17_2: D17.2(K) R47.1
NetD18_2: D18.2(K) R49.1
NetD20_2: D20.2(K) R53.1
NetD21_2: D21.2(K) R57.1
NetD22_2: D22.2(K) R60.1
NetD23_1: D23.1 R62.2
NetD24_1: D24.1 R63.2
NetD25_2: D25.2(K) R64.1
NetD26_1: D26.1 R67.2
NetD27_2: D27.2(K) R68.1
NetD28_2: D28.2(K) R72.1
NetD32_2: D32.2(K) R76.1
NetD34_2: D34.2(K) R79.1
NetD35_2: D35.2(K) R83.1
NetD36_1: D36.1 U5.1(S2) U7.1(S2) U9.1(S2) U11.1(S2) U14.1(S2) U16.1(S2) U17.1(S2) U18.1(S2) U19.1(S2) U20.1(S2)
NetD36_2: D36.2(K) R85.2 U21.3(In1+)
NetD38_1: D38.1(A) Q26.3 R95.1
NetD39_2: D39.2(K) R103.1
NetJ8_1: J8.1 R91.2 U21.5(In2+)
NetJ8_2: J8.2 R89.1
NetJ9_9: J9.9 R99.1
NetJ9_12: J9.12 R99.2(W)
NetQ4_1: Q4.1 R10.2
NetQ4_3: Q4.3 R9.2 U5.2(G2)
NetQ5_1: Q5.1 R13.2
NetQ5_3: Q5.3 R12.2
NetQ6_1: Q6.1 R15.2
NetQ6_3: Q6.3 R14.2 U7.2(G2)
NetQ7_1: Q7.1 R21.2
NetQ7_3: Q7.3 R19.2
NetQ8_1: Q8.1 R22.2
NetQ8_3: Q8.3 R17.1 U6.2(~{RE}) U6.3(DE)
NetQ9_1: Q9.1 R25.2
NetQ9_3: Q9.3 R23.2 U9.2(G2)
NetQ10_1: Q10.1 R30.2
NetQ10_3: Q10.3 R28.2
NetQ11_1: Q11.1 R32.2
NetQ11_3: Q11.3 R31.2 U11.2(G2)
NetQ12_1: Q12.1 R37.2
NetQ12_3: Q12.3 R34.2
NetQ13_1: Q13.1 R40.2
NetQ13_3: Q13.3 R38.2 U14.2(G2)
NetQ14_1: Q14.1 R47.2
NetQ14_3: Q14.3 R42.2
NetQ15_1: Q15.1 R49.2
NetQ15_3: Q15.3 R48.2 U16.2(G2)
NetQ16_1: Q16.1 R53.2
NetQ16_3: Q16.3 R51.2
NetQ17_1: Q17.1 R57.2
NetQ17_3: Q17.3 R55.2 U17.2(G2)
NetQ18_1: Q18.1 R60.2
NetQ18_3: Q18.3 R59.2
NetQ19_1: Q19.1 R64.2
NetQ19_3: Q19.3 R61.2 U18.2(G2)
NetQ20_1: Q20.1 R68.2
NetQ20_3: Q20.3 R66.2
NetQ21_1: Q21.1 R72.2
NetQ21_3: Q21.3 R69.2 U19.2(G2)
NetQ22_1: Q22.1 R76.2
NetQ22_3: Q22.3 R74.2
NetQ23_1: Q23.1 R79.2
NetQ23_3: Q23.3 R78.2 U20.2(G2)
NetQ24_1: Q24.1 R83.2
NetQ24_3: Q24.3 R81.2
NetQ25_1: Q25.1 R98.2
NetQ25_3: Q25.3 U22.2(B)
NetQ26_1: Q26.1 R102.2
NetQ27_1: Q27.1 R104.2
NetQ28_1: Q28.1 R105.2
NetQ29_1: Q29.1 R106.2
NetQ30_1: Q30.1 R107.2
NetQ31_1: Q31.1 R116.2
NetQ32_1: Q32.1 R117.2
NetQ33_1: Q33.1 R118.2
NetQ34_1: Q34.1 R119.2
NetR11_2: R11.2 R12.1 U5.4(G1)
NetR18_2: R18.2 R19.1 U7.4(G1)
NetR27_2: R27.2 R28.1 U9.4(G1)
NetR33_2: R33.2 R34.1 U11.4(G1)
NetR39_1: R39.1 R44.2 U12.5(VSENSE)
NetR41_2: R41.2 R42.1 U14.4(G1)
NetR50_2: R50.2 R51.1 U16.4(G1)
NetR54_1: R54.1 U15.13(~{OE})
NetR56_1: R56.1 U15.10(~{MR})
NetR58_2: R58.2 R59.1 U17.4(G1)
NetR65_2: R65.2 R66.1 U18.4(G1)
NetR73_2: R73.2 R74.1 U19.4(G1)
NetR80_2: R80.2 R81.1 U20.4(G1)
NetR86_1: R86.1 U21.2(In1-)
NetR93_1: R93.1 U21.6(In2-)

Not connected (* = marked no-connect by the designer): J9 18; R87 3 4 5 6; R97 3 6; U4 23(PG4) 89(NC) 91(NC) 92(NC) 94(NC) 96(NC); U12 3(EN); U13 1(X1) 2(X2); U15 9(Q7S)

## Notes on the sheet
- 5
- 485接口
- 5V->3.5V
- 铁电
- ADJ引脚可以接一个5NF的电容到地（可减小反馈波纹），对应TPS5450输出频率500KHz
- (near U12) 24V->5V
- (near U13) RTC
- (near U15) 移位寄存器-多路控制信号
- 指示灯
- mcu供电滤波电路
- (near L2) 参考电压供电电路
- (near L3) 模拟电压供电电路
- LDO_CAP引脚总电容2.2UF
- 电池检测
- 晶振电路
- @这里要加二极管，否则电池充电
- (near R82) 复位电路
- AO4611/AO4618/NCE603S/NCE4688
- 门碰
- 放大8倍
- 10NF滤波，100NF会有波形损失
- NTC温度采集
- 轻触按钮
- 掉货检测
- 蜂鸣器
- USB Host 接口
- 注意选取的运放的Vos（输入失调电压：+-输入同样电压时，输出不为0）
- 屏幕接口（这里用个拨码开关来切换3V/5V）
- (near R104) 矩阵键盘
- 日志与读卡头接口
- Labels drawn without touching a wire or pin: COLD_EN, GLASS_EN, HOT_EN, LED_EN, WIND_EN

## Library data of the parts
B1 = BATTERY: 电池座
C17 C19 C21-C24 C26-C28 C30-C50 C52-C63 = CAP: 无极性电容
C18 C51 = CAP POLAR: 钽电容
C20 = CAP POLAR: 极性电容
C25 = CAP POLAR: 电解电容
C29 = CAP POLAR: 直插电解电容
D7 D9 D11 D13 D16 D18 D21 D25 D28 D34 = Diodes: 二极管
D8 D10 D12 D14 D17 D20 D22 D27 D31-D33 D35 D38 D39 = 1N4148: 高速开关二极管
D15 = Diodes: 肖特基二极管/10A
D19 = Zener diode: 稳压二极管; Published: 8-Jun-2000; LatestRevisionDate: 17-Jul-2002; LatestRevisionNote: Re-released for DXP Platform.; PackageReference: DIODE-0.7; Publisher: Altium Limited
D23 D24 D26 = LED: 发光二极管
D29 D30 D37 D40-D47 = TVS: TVS 瞬态抑制二极管; Published: 8-Jun-2000; LatestRevisionDate: 17-Jul-2002; LatestRevisionNote: Re-released for DXP Platform.; PackageReference: DIODE-0.7; Publisher: Altium Limited
D36 = SS54: 肖特基二极管; Published: 8-Jun-2000; LatestRevisionDate: 17-Jul-2002; LatestRevisionNote: Re-released for DXP Platform.; PackageReference: DIODE-0.7; Publisher: Altium Limited
J3 J6 J11 = SIP-4: 单排4P插座
J4 J7 J8 = SIP-2: 单排2P插座
J5 J9 = DIP-2*10: 双排2*10P插座
J10 = SIP-3: 单排3P插座
L1-L4 = INDUCTOR: 电感
P1 = USB: USB座
Q4-Q7 Q9-Q24 Q26 = BC817-40: NPN三极管; Ic: 0.5A; Vceo: 45V; Vcbo: 50V; Vebo: 5V; Pc: 0.3W
Q8 Q25 Q31-Q34 = S8050: NPN
Q27-Q30 = S8550: PNP
R9-R86 R89-R91 R93-R96 R98 R100-R119 = RES2: 电阻
R87 R88 R92 R97 = Res Pack x4: 排阻
R99 = POT2: 可调电位器
S1-S4 = SW-PB: 轻触开关
U4 = M482KIDAE: 新唐 M482KIDAE
U5 U7 U9 U11 U14 U16-U20 = AO4611: 互补型mos
U6 = MAX3485: 485总线收发器（3.3V）
U8 = AMS1084-ADJ: LDO电压转换
U10 = FM24CL64B: CYPRESS-64Kbit
U12 = TPS54531: DC-DC/5A
U13 = GC1307: RTC 芯片
U15 = 74HC595: 串入并出移位寄存器
U21 = DUAL OPAMP: 双运放
U22 = BUZZER: 有源蜂鸣器-9055/3V
U23 = ST3232: RS232电平转换/3.3V
X1 = CRYSTAL: 无源晶振
X2 = CRYSTAL_2P: 无源晶振2脚